# Altium schematic sheet STM32F407.SchDoc
size A3
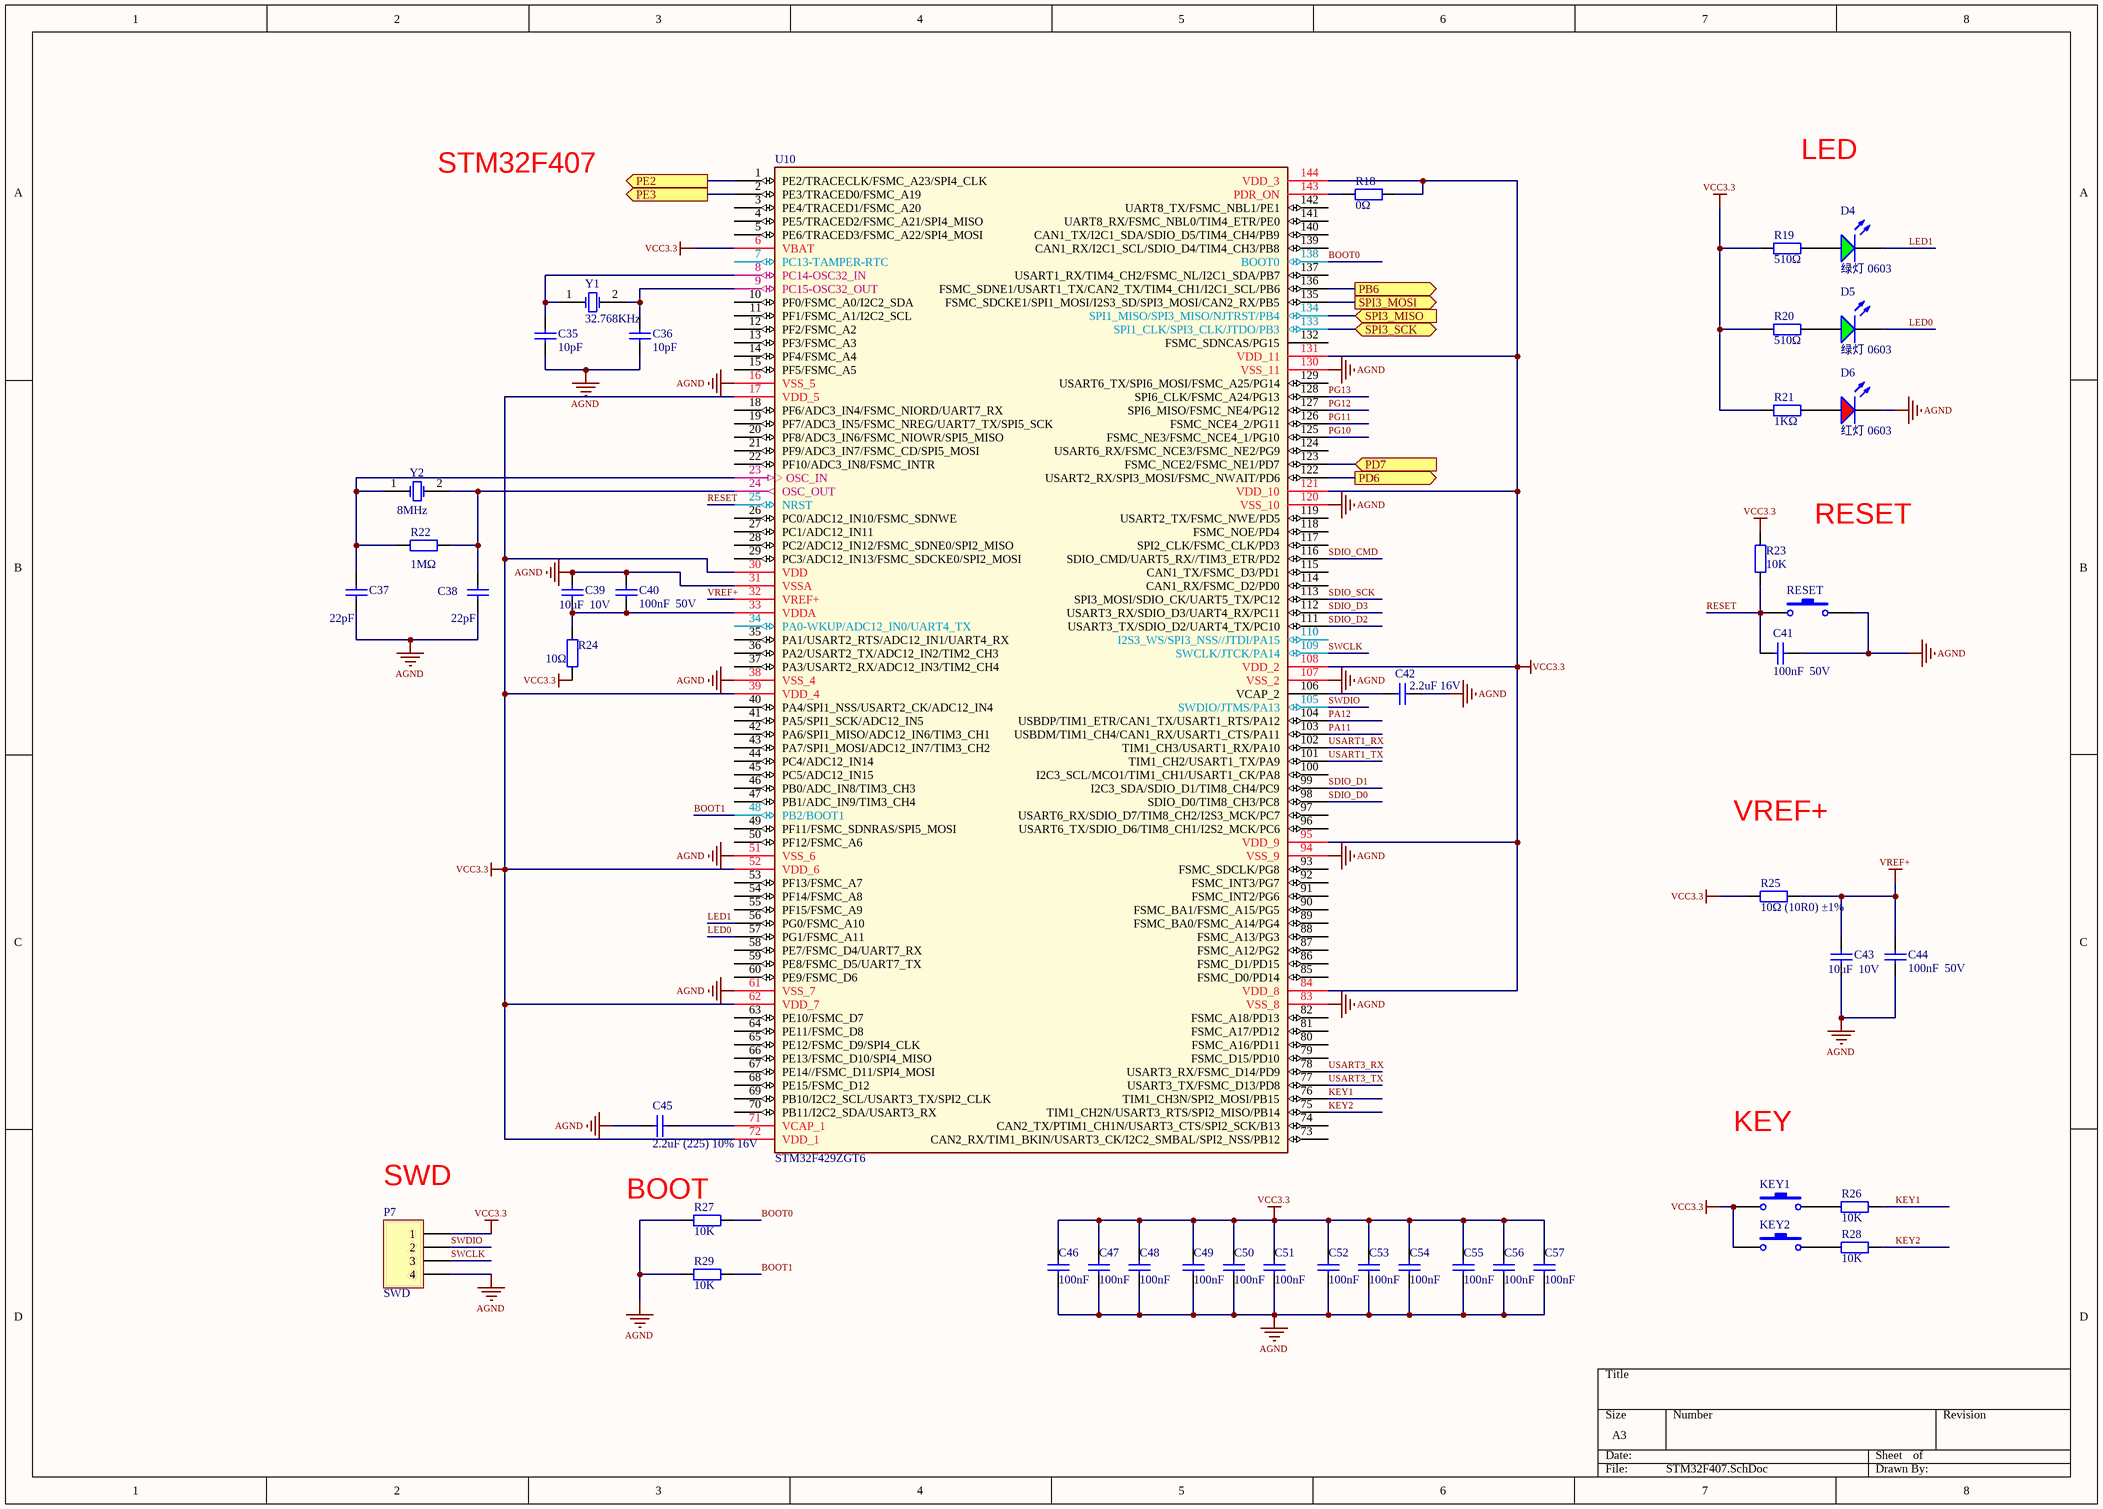
[diagram p0: STM32F407.SchDoc]

## Parts
C35  10pF  [0402_C]
C36  10pF  [0402_C]
C37  22pF  [0402_C]
C38  22pF  [0402_C]
C39  10uF  10V  [0402_C]
C40  100nF  50V  [0402_C]
C41  100nF  50V  [0402_C]
C42  2.2uF 16V  [0603_C]
C43  10uF  10V  [0402_C]
C44  100nF  50V  [0402_C]
C45  2.2uF (225) 10% 16V  [0603_C]
C46  100nF  [0402_C]
C47  100nF  [0402_C]
C48  100nF  [0402_C]
C49  100nF  [0402_C]
C50  100nF  [0402_C]
C51  100nF  [0402_C]
C52  100nF  [0402_C]
C53  100nF  [0402_C]
C54  100nF  [0402_C]
C55  100nF  [0402_C]
C56  100nF  [0402_C]
C57  100nF  [0402_C]
D4  绿灯 0603  [0603_LED_S1]
D5  绿灯 0603  [0603_LED_S1]
D6  红灯 0603  [0603_LED_S1]
KEY1  SW-PB  [KEY_3.6*2.5]  (value not drawn)
KEY2  SW-PB  [KEY_3.6*2.5]  (value not drawn)
P7  SWD  [HDR1X4]
R18  0Ω  [0402_R]
R19  510Ω  [0402_R]
R20  510Ω  [0402_R]
R21  1KΩ  [0402_R]
R22  1MΩ  [0402_R]
R23  10K  [0402_R]
R24  10Ω  [0402_R]
R25  10Ω (10R0) ±1%  [0402_R]
R26  10K  [0402_R]
R27  10K  [0402_R]
R28  10K  [0402_R]
R29  10K  [0402_R]
RESET  SW-PB  [KEY_3.6*2.5]  (value not drawn)
U10  STM32F429ZGT6  [LQFP-144_20x20x05P]
Y1  32.768KHz  [SMD-3215_2P FC - 135]
Y2  8MHz  [SMD-5032_2P]

## Ports
PB6 (out), PD6 (out), PD7 (in), PE2 (out), PE3 (out), SPI3_MISO (in), SPI3_MOSI (out), SPI3_SCK (bidir)

## Nets
AGND: C35.1 C36.1 C37.1 C38.1 C39.2 C40.2 C41.1 C42.1 C43.1 C44.1 C45.1 C46.1 C47.1 C48.1 C49.1 C50.1 C51.1 C52.1 C53.1 C54.1 C55.1 C56.1 C57.1 D6.K P7.4 R27.1 R29.1 RESET.2 U10.16(VSS_5) U10.31(VSSA) U10.38(VSS_4) U10.51(VSS_6) U10.61(VSS_7) U10.83(VSS_8) U10.94(VSS_9) U10.107(VSS_2) U10.120(VSS_10) U10.130(VSS_11)
VCC3.3: C46.2 C47.2 C48.2 C49.2 C50.2 C51.2 C52.2 C53.2 C54.2 C55.2 C56.2 C57.2 KEY1.1 KEY2.1 P7.1 R18.1 R19.1 R20.1 R21.1 R23.1 R24.1 R25.2 U10.6(VBAT) U10.17(VDD_5) U10.30(VDD) U10.39(VDD_4) U10.52(VDD_6) U10.62(VDD_7) U10.72(VDD_1) U10.84(VDD_8) U10.95(VDD_9) U10.108(VDD_2) U10.121(VDD_10) U10.131(VDD_11) U10.144(VDD_3)
VREF+: C43.2 C44.2 R25.1 U10.32(VREF+)
BOOT0: R27.2 U10.138(BOOT0)
BOOT1: R29.2 U10.48(PB2/BOOT1)
KEY1: R26.2 U10.76(TIM1_CH3N/SPI2_MOSI/PB15)
KEY2: R28.2 U10.75(TIM1_CH2N/USART3_RTS/SPI2_MISO/PB14)
LED0: D5.K U10.57(PG1/FSMC_A11)
LED1: D4.K U10.56(PG0/FSMC_A10)
PA11: U10.103(USBDM/TIM1_CH4/CAN1_RX/USART1_CTS/PA11)
PA12: U10.104(USBDP/TIM1_ETR/CAN1_TX/USART1_RTS/PA12)
PB6: U10.136(FSMC_SDNE1/USART1_TX/CAN2_TX/TIM4_CH1/I2C1_SCL/PB6) ; port PB6
PD6: U10.122(USART2_RX/SPI3_MOSI/FSMC_NWAIT/PD6) ; port PD6
PD7: U10.123(FSMC_NCE2/FSMC_NE1/PD7) ; port PD7
PE2: U10.1(PE2/TRACECLK/FSMC_A23/SPI4_CLK) ; port PE2
PE3: U10.2(PE3/TRACED0/FSMC_A19) ; port PE3
PG10: U10.125(FSMC_NE3/FSMC_NCE4_1/PG10)
PG11: U10.126(FSMC_NCE4_2/PG11)
PG12: U10.127(SPI6_MISO/FSMC_NE4/PG12)
PG13: U10.128(SPI6_CLK/FSMC_A24/PG13)
RESET: C41.2 R23.2 RESET.1 U10.25(NRST)
SDIO_CMD: U10.116(SDIO_CMD/UART5_RX//TIM3_ETR/PD2)
SDIO_D0: U10.98(SDIO_D0/TIM8_CH3/PC8)
SDIO_D1: U10.99(I2C3_SDA/SDIO_D1/TIM8_CH4/PC9)
SDIO_D2: U10.111(USART3_TX/SDIO_D2/UART4_TX/PC10)
SDIO_D3: U10.112(USART3_RX/SDIO_D3/UART4_RX/PC11)
SDIO_SCK: U10.113(SPI3_MOSI/SDIO_CK/UART5_TX/PC12)
SPI3_MISO: U10.134(SPI1_MISO/SPI3_MISO/NJTRST/PB4) ; port SPI3_MISO
SPI3_MOSI: U10.135(FSMC_SDCKE1/SPI1_MOSI/I2S3_SD/SPI3_MOSI/CAN2_RX/PB5) ; port SPI3_MOSI
SPI3_SCK: U10.133(SPI1_CLK/SPI3_CLK/JTDO/PB3) ; port SPI3_SCK
SWCLK: P7.3 U10.109(SWCLK/JTCK/PA14)
SWDIO: P7.2 U10.105(SWDIO/JTMS/PA13)
USART1_RX: U10.102(TIM1_CH3/USART1_RX/PA10)
USART1_TX: U10.101(TIM1_CH2/USART1_TX/PA9)
USART3_RX: U10.78(USART3_RX/FSMC_D14/PD9)
USART3_TX: U10.77(USART3_TX/FSMC_D13/PD8)
NetC35_2: C35.2 U10.8(PC14-OSC32_IN) Y1.1(OSC1)
NetC36_2: C36.2 U10.9(PC15-OSC32_OUT) Y1.2(OSC2)
NetC37_2: C37.2 R22.1 U10.23(OSC_IN) Y2.1(OSC1)
NetC38_2: C38.2 R22.2 U10.24(OSC_OUT) Y2.2(OSC2)
NetC39_1: C39.1 C40.1 R24.2 U10.33(VDDA)
NetC42_2: C42.2 U10.106(VCAP_2)
NetC45_2: C45.2 U10.71(VCAP_1)
NetD4_A: D4.A R19.2
NetD5_A: D5.A R20.2
NetD6_A: D6.A R21.2
NetKEY1_2: KEY1.2 R26.1
NetKEY2_2: KEY2.2 R28.1
NetR18_2: R18.2 U10.143(PDR_ON)

Not connected (* = marked no-connect by the designer): U10 3(PE4/TRACED1/FSMC_A20) 4(PE5/TRACED2/FSMC_A21/SPI4_MISO) 5(PE6/TRACED3/FSMC_A22/SPI4_MOSI) 7(PC13-TAMPER-RTC) 10(PF0/FSMC_A0/I2C2_SDA) 11(PF1/FSMC_A1/I2C2_SCL) 12(PF2/FSMC_A2) 13(PF3/FSMC_A3) 14(PF4/FSMC_A4) 15(PF5/FSMC_A5) 18(PF6/ADC3_IN4/FSMC_NIORD/UART7_RX) 19(PF7/ADC3_IN5/FSMC_NREG/UART7_TX/SPI5_SCK) 20(PF8/ADC3_IN6/FSMC_NIOWR/SPI5_MISO) 21(PF9/ADC3_IN7/FSMC_CD/SPI5_MOSI) 22(PF10/ADC3_IN8/FSMC_INTR) 26(PC0/ADC12_IN10/FSMC_SDNWE) 27(PC1/ADC12_IN11) 28(PC2/ADC12_IN12/FSMC_SDNE0/SPI2_MISO) 29(PC3/ADC12_IN13/FSMC_SDCKE0/SPI2_MOSI) 34(PA0-WKUP/ADC12_IN0/UART4_TX) 35(PA1/USART2_RTS/ADC12_IN1/UART4_RX) 36(PA2/USART2_TX/ADC12_IN2/TIM2_CH3) 37(PA3/USART2_RX/ADC12_IN3/TIM2_CH4) 40(PA4/SPI1_NSS/USART2_CK/ADC12_IN4) 41(PA5/SPI1_SCK/ADC12_IN5) 42(PA6/SPI1_MISO/ADC12_IN6/TIM3_CH1) 43(PA7/SPI1_MOSI/ADC12_IN7/TIM3_CH2) 44(PC4/ADC12_IN14) 45(PC5/ADC12_IN15) 46(PB0/ADC_IN8/TIM3_CH3) 47(PB1/ADC_IN9/TIM3_CH4) 49(PF11/FSMC_SDNRAS/SPI5_MOSI) 50(PF12/FSMC_A6) 53(PF13/FSMC_A7) 54(PF14/FSMC_A8) 55(PF15/FSMC_A9) 58(PE7/FSMC_D4/UART7_RX) 59(PE8/FSMC_D5/UART7_TX) 60(PE9/FSMC_D6) 63(PE10/FSMC_D7) 64(PE11/FSMC_D8) 65(PE12/FSMC_D9/SPI4_CLK) 66(PE13/FSMC_D10/SPI4_MISO) 67(PE14//FSMC_D11/SPI4_MOSI) 68(PE15/FSMC_D12) 69(PB10/I2C2_SCL/USART3_TX/SPI2_CLK) 70(PB11/I2C2_SDA/USART3_RX) 73(CAN2_RX/TIM1_BKIN/USART3_CK/I2C2_SMBAL/SPI2_NSS/PB12) 74(CAN2_TX/PTIM1_CH1N/USART3_CTS/SPI2_SCK/B13) 79(FSMC_D15/PD10) 80(FSMC_A16/PD11) 81(FSMC_A17/PD12) 82(FSMC_A18/PD13) 85(FSMC_D0/PD14) 86(FSMC_D1/PD15) 87(FSMC_A12/PG2) 88(FSMC_A13/PG3) 89(FSMC_BA0/FSMC_A14/PG4) 90(FSMC_BA1/FSMC_A15/PG5) 91(FSMC_INT2/PG6) 92(FSMC_INT3/PG7) 93(FSMC_SDCLK/PG8) 96(USART6_TX/SDIO_D6/TIM8_CH1/I2S2_MCK/PC6) 97(USART6_RX/SDIO_D7/TIM8_CH2/I2S3_MCK/PC7) 100(I2C3_SCL/MCO1/TIM1_CH1/USART1_CK/PA8) 110(I2S3_WS/SPI3_NSS//JTDI/PA15) 114(CAN1_RX/FSMC_D2/PD0) 115(CAN1_TX/FSMC_D3/PD1) 117(SPI2_CLK/FSMC_CLK/PD3) 118(FSMC_NOE/PD4) 119(USART2_TX/FSMC_NWE/PD5) 124(USART6_RX/FSMC_NCE3/FSMC_NE2/PG9) 129(USART6_TX/SPI6_MOSI/FSMC_A25/PG14) 132(FSMC_SDNCAS/PG15) 137(USART1_RX/TIM4_CH2/FSMC_NL/I2C1_SDA/PB7) 139(CAN1_RX/I2C1_SCL/SDIO_D4/TIM4_CH3/PB8) 140(CAN1_TX/I2C1_SDA/SDIO_D5/TIM4_CH4/PB9) 141(UART8_RX/FSMC_NBL0/TIM4_ETR/PE0) 142(UART8_TX/FSMC_NBL1/PE1)

## Notes on the sheet
- STM32F407
- LED
- RESET
- VREF+
- (near P7) SWD
- KEY
- (near R27) BOOT

## Library data of the parts
C35 C36 = 0603 10pF (100) 5% 50V: 贴片电容; ComponentLink1Description: 供应商链接; ComponentLink1URL: http://www.szlcsc.com/product/details_1986.html; Package: 0603; Supplier: LC; SuppliersPartNumber: C1634
C37 C38 = 0603 22pF (220) 5% 50V: 贴片电容; ComponentLink1Description: 供应商链接; ComponentLink1URL: http://www.szlcsc.com/product/details_2005.html; Package: 0603; Supplier: LC; SuppliersPartNumber: C1653
C39 C43 = 0603 10uF (106) 10% 10V: 贴片电容; ComponentLink1Description: 供应商链接; ComponentLink1URL: http://www.szlcsc.com/product/details_20411.html; Package: 0603; Supplier: LC; SuppliersPartNumber: C19702
C40 C41 C44 = 0603 100nF (104) 10% 50V: 贴片电容; ComponentLink1Description: 供应商链接; ComponentLink1URL: http://www.szlcsc.com/product/details_15331.html; Package: 0603; Supplier: LC; SuppliersPartNumber: C14663
C42 C45 = 0603 2.2uF (225) 10% 16V: 贴片电容; ComponentLink1Description: 供应商链接; ComponentLink1URL: http://www.szlcsc.com/product/details_24366.html; Package: 0603; Supplier: LC; SuppliersPartNumber: C23630
C46-C57 = 0402 100nF (104) 10% 16V: 贴片电容; ComponentLink1Description: 供应商链接; ComponentLink1URL: http://www.szlcsc.com/product/details_1877.html; Package: 0402; Supplier: LC; SuppliersPartNumber: C1525
D4 D5 = 0603 绿灯: 发光二极管; ComponentLink1Description: 供应商链接; ComponentLink1URL: http://www.szlcsc.com/product/details_73152.html; Package: 0603; Supplier: LC; SuppliersPartNumber: C72043
D6 = 0603 红灯: 发光二极管; ComponentLink1Description: 供应商链接; ComponentLink1URL: http://www.szlcsc.com/product/details_2659.html; Package: 0603; Supplier: LC; SuppliersPartNumber: C2286
KEY1 KEY2 RESET = SW-PB: Switch; Published: 24-Mar-1999; LatestRevisionDate: 17-Jul-2002; LatestRevisionNote: Re-released for DXP Platform.; PackageReference: SPST-2; Publisher: Altium Limited; PackageDescription: Switch; 2 Leads
P7 = Header 4: Header, 4-Pin; LatestRevisionDate: 17-Jul-2002; LatestRevisionNote: Re-released for DXP Platform.; Publisher: Altium Limited
R18 = 0603 0Ω (0R0) 1%: 贴片电阻; ComponentLink1Description: 供应商链接; ComponentLink1URL: http://www.szlcsc.com/product/details_21903.html; Package: 0603; Supplier: LC; SuppliersPartNumber: C21189
R19 R20 = 0603 510Ω (5100) 1%: 贴片电阻; ComponentLink1Description: 供应商链接; ComponentLink1URL: http://www.szlcsc.com/product/details_23920.html; Package: 0603; Supplier: LC; SuppliersPartNumber: C23193
R21 = 0603 1KΩ (1001) 1%: 贴片电阻; ComponentLink1Description: 供应商链接; ComponentLink1URL: http://www.szlcsc.com/product/details_21904.html; Package: 0603; Supplier: LC; SuppliersPartNumber: C21190
R22 = 0603 1.2MΩ (1204) 1%: 贴片电阻; ComponentLink1Description: 供应商链接; ComponentLink1URL: http://www.szlcsc.com/product/details_23493.html; Package: 0603; Supplier: LC; SuppliersPartNumber: C22766
R23-R29 = 0603 10Ω (10R0) 1%: 贴片电阻; ComponentLink1Description: 供应商链接; ComponentLink1URL: http://www.szlcsc.com/product/details_23586.html; Package: 0603; Supplier: LC; SuppliersPartNumber: C22859
U10 = STM32F429ZGT6: ARM; ComponentLink1Description: 供应商链接; ComponentLink1URL: http://www.szlcsc.com/product/details_47529.html; Package: LQFP-144_20x20x05P; Supplier: LC; SuppliersPartNumber: C46525
Y1 = SMD-3215_2P 32.768KHz 20ppm 12.5pF: 贴片晶振; ComponentLink1Description: 供应商链接; ComponentLink1URL: http://www.szlcsc.com/product/details_33310.html; Package: SMD-3215_2P; Supplier: LC; SuppliersPartNumber: C32346
Y2 = SMD-5032_2P 8MHz 20ppm 20pF: 贴片晶振; ComponentLink1Description: 供应商链接; ComponentLink1URL: http://www.szlcsc.com/product/details_117214.html; Package: SMD-5032_2P; Supplier: LC; SuppliersPartNumber: C115962